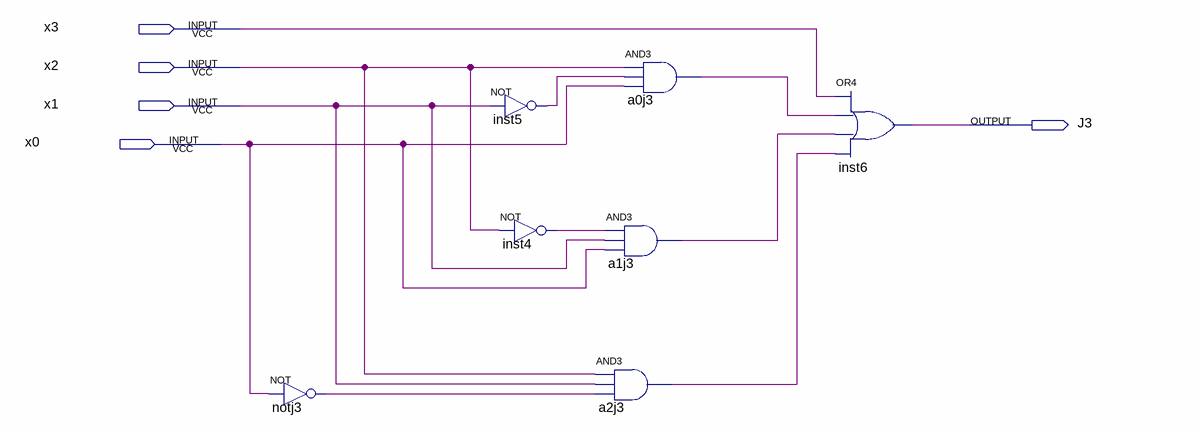
[diagram p0: schematic sheet]
// Quartus schematic J3.bdf as structural Verilog: 7 symbols, 5 pins
module J3 (
  input  x3,
  input  x2,
  input  x1,
  input  x0,
  output J3
);

  wire a0j3_out, a1j3_out, a2j3_out, inst4_out, inst5_out, notj3_out;

  not notj3 (notj3_out, x0);
  not inst5 (inst5_out, x1);
  not inst4 (inst4_out, x2);
  and a1j3 (a1j3_out, inst4_out, x1, x0);
  and a2j3 (a2j3_out, x2, x1, notj3_out);
  and a0j3 (a0j3_out, x2, inst5_out, x0);
  or inst6 (J3, x3, a0j3_out, a1j3_out, a2j3_out);
endmodule
